# Altium schematic sheet Modulo_22.SchDoc
size A4; SheetNumber: 1; SheetTotal: 1; SPICEModelCacheRCUFKPFU: <root> / <DocumentId>RCUFKPFU</DocumentId> / </root>
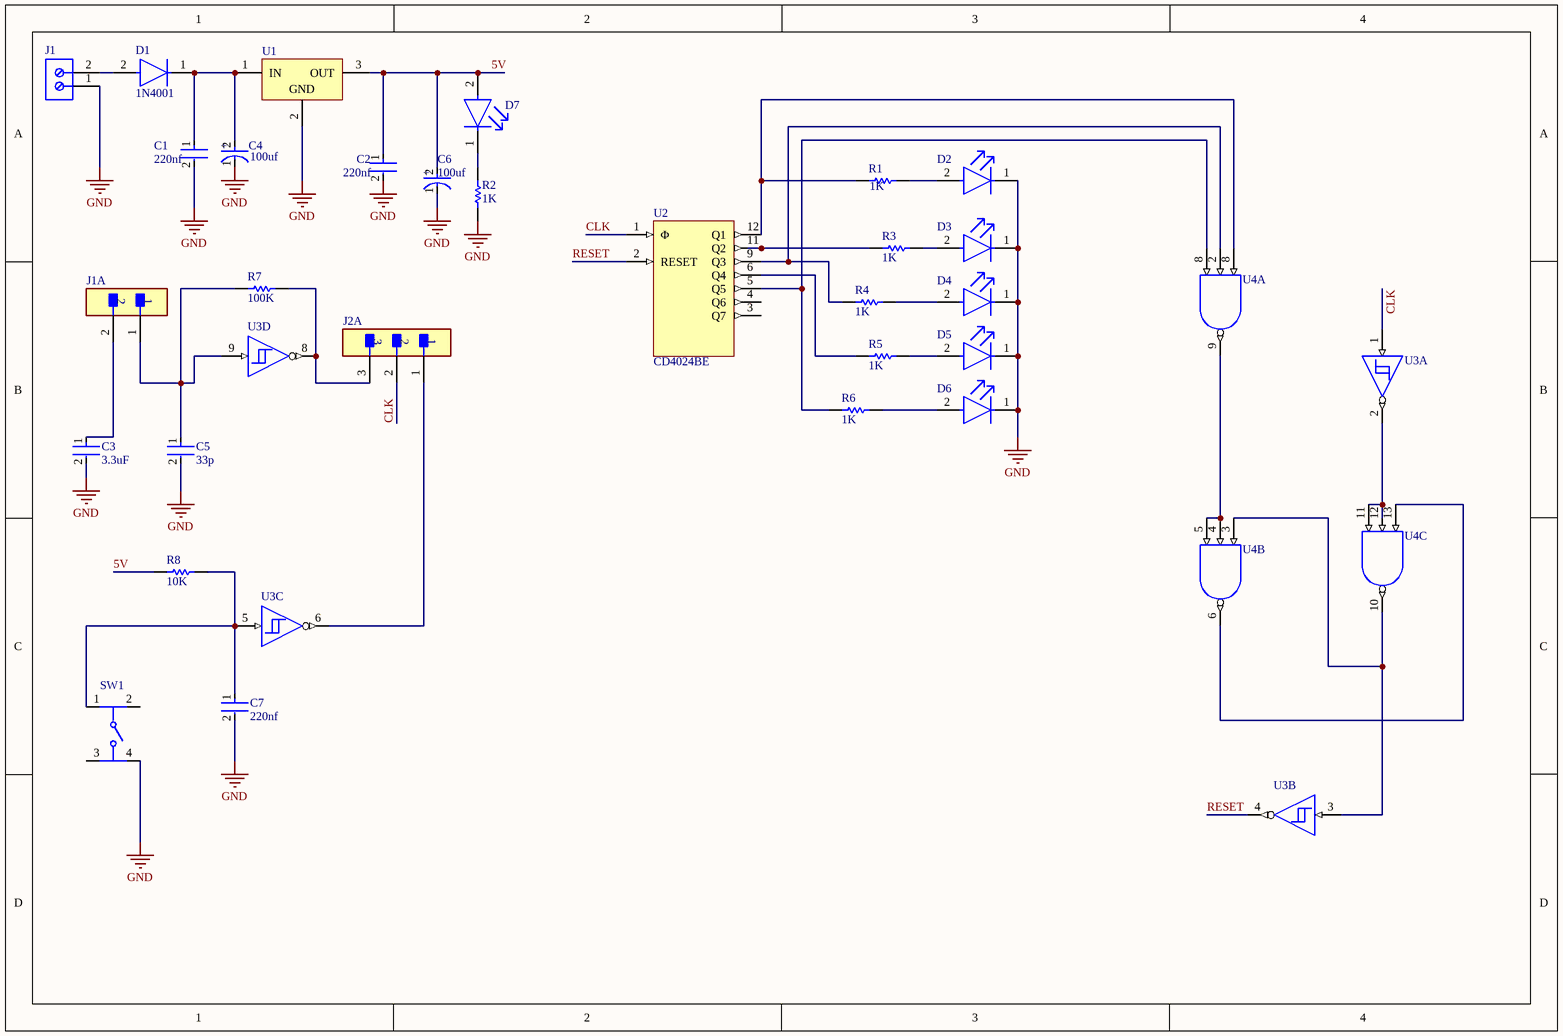
[diagram p0: Modulo_22.SchDoc]

## Parts
C1  220nf  [FP-RDE0P1-MFG]
C2  220nf  [FP-RDE0P1-MFG]
C3  3.3uF  [FP-RDE0P1-MFG]
C4  100uf  [FP-RAD-TH-D_6_3_0_5-L_11-MFG]
C5  33p  [FP-RDE0P1-MFG]
C6  100uf  [FP-RAD-TH-D_6_3_0_5-L_11-MFG]
C7  220nf  [FP-RDE0P1-MFG]
D1  1N4001  [FP-1N4001-E3-73-MFG]
D2  TLLG4400-AS12  [FP-6_544-5255_01-4-MFG]  (value not drawn)
D3  TLLG4400-AS12  [FP-6_544-5255_01-4-MFG]  (value not drawn)
D4  TLLG4400-AS12  [FP-6_544-5255_01-4-MFG]  (value not drawn)
D5  TLLG4400-AS12  [FP-6_544-5255_01-4-MFG]  (value not drawn)
D6  TLLG4400-AS12  [FP-6_544-5255_01-4-MFG]  (value not drawn)
D7  TLLG4400-AS12  [FP-6_544-5255_01-4-MFG]  (value not drawn)
J1  282836-2  [TECO-282836-2_V]  (value not drawn)
J1A  TSW-102-14-G-S  [FP-TSW-102-14-G-S-MFG]  (value not drawn)
J2A  PR20203VBNN  [FP-PR20203VBNN-MFG]  (value not drawn)
R1  1K  [RESA60-630X240]
R2  1K  [RESA60-630X240]
R3  1K  [RESA60-630X240]
R4  1K  [RESA60-630X240]
R5  1K  [RESA60-630X240]
R6  1K  [RESA60-630X240]
R7  100K  [RESA60-630X240]
R8  10K  [RESA60-630X240]
SW1  TL1105AF160Q  [FP-TL1105AF160Q-MFG]  (value not drawn)
U1  L7805CP  [TO220FP]  (value not drawn)
U2  CD4024BE  [N0014A]
U3  CD40106BE  [N0014A]  (value not drawn)  (parts A,B,C,D of 7)
U4  CD4023BF  [J0014A]  (value not drawn)  (parts A,B,C of 4)

## Nets
GND: C1.2 C2.2 C3.2 C4.1(C) C5.2 C6.1(C) C7.2 D2.1(C) D3.1(C) D4.1(C) D5.1(C) D6.1(C) J1.1 R2.1 SW1.4 U1.2(GND)
5V: C2.1 C6.2(A) D7.2(A) R8.1 U1.3(OUT)
CLK: J2A.2 U2.1(Φ) U3.1(A)
RESET: U2.2(RESET) U3.4(H=~{B})
NetC1_1: C1.1 C4.2(A) D1.1(C) U1.1(IN)
NetC3_1: C3.1 J1A.2
NetC5_1: C5.1 J1A.1 R7.1 U3.9(D)
NetC7_1: C7.1 R8.2 SW1.1 U3.5(C)
NetD1_2: D1.2(A) J1.2
NetD2_2: D2.2(A) R1.2
NetD3_2: D3.2(A) R3.2
NetD4_2: D4.2(A) R4.2
NetD5_2: D5.2(A) R5.2
NetD6_2: D6.2(A) R6.2
NetD7_1: D7.1(C) R2.2
NetJ2A_1: J2A.1 U3.6(I=~{C})
NetJ2A_3: J2A.3 R7.2 U3.8(J=~{D})
NetR1_1: R1.1 U2.12(Q1) U4.8(C)
NetR3_1: R3.1 U2.11(Q2)
NetR4_1: R4.1 U2.9(Q3) U4.2(B)
NetR5_1: R5.1 U2.6(Q4)
NetR6_1: R6.1 U2.5(Q5) U4.8(C)
NetU3_2: U3.2(G=~{A}) U4.11(I) U4.12(H)
NetU3_3: U3.3(B) U4.3(D) U4.10(L)
NetU4_4: U4.4(E) U4.5(F) U4.9(J)
NetU4_6: U4.6(K) U4.13(G)

Not connected (* = marked no-connect by the designer): SW1 2 3; U2 3(Q7) 4(Q6)

## Notes on the sheet
- (in symbol CMP-05427-000856-1) +

## Library data of the parts
C1-C3 C5 C7 = CMP-06035-012212-1: Ceramic Capacitor 5pF ±0.25pF 50V C0G Radial; Lead Diameter: 0.5mm; Termination: Radial; Mount: Through Hole; Dielectric: C0G; Height - Seated (Max): 0.236inch; Height: 3.5mm; Length: 0.197inch; Min Operating Temperature: -55°C; Resistor Type: Ceramic; Package Quantity: 500; Voltage Rating: 50V; Lead Pitch: 0.098inch; Width: 0.098inch; Voltage Rating (DC): 50V; Packaging: Bulk; Case/Package: Radial; Max Operating Temperature: 125°C; Capacitance: 5pF
C4 C6 = CMP-05427-000856-1: Aluminum Electrolytic Capacitors (Radial Lead Type) 100uF ±20% 25V; Lead Diameter: 0.5mm; Polarity: Polar; Ripple Current: 455mA; Impedance: 130mR; Life (Hours): 2000Hour; Length: 11mm; Min Operating Temperature: -40°C; Termination: Radial; Diameter: 6mm; Lead Pitch: 5mm; Tolerance: 20%; Capacitance: 100uF; Case/Package: Radial; Voltage Rating (DC): 25V; Height - Seated (Max): 0.5inch; RoHS Compliant: Yes; Series: FM; Package Quantity: 2000; Voltage Rating: 25V; Max Operating Temperature: 105°C; Mount: Through Hole; ESR (Equivalent Series Resistance): 130mR; Packaging: Tape and Reel
D1 = CMP-02540-000001-1: DIODE GEN PURP 50V 1A DO204AL; Manufacturer Part Number: 1N4001-E3/73; Manufacturer: Vishay; Max Surge Forward Current: 30A; Value: 15pF; Peak Reverse Current: 5uA; Max Junction Temp: +150°C; Lead Free: Yes; Height: 2.7mm; Digikey Description: DIODE GEN PURP 50V 1A DO204AL; Reverse Voltage: 50V; Package: 1N4001-E3/73; RoHS: TRUE; Temperature: -50°C to +150°C; Device Class L2: Diodes; Forward Current: 1A; Max Repetitive Reverse Voltage: 50V; Device Class L1: Discrete Semiconductors; Device Class L3: Rectifier Diodes; Capacitance: 15pF; Temperature Range High: +150°C; Category: Diode; Ipc Land Pattern Name: DIOPA1088W105L520D270; ComponentLink2URL: http://www.vishay.com/docs/88503/1n4001.pdf; Octopart: https://octopart.com/1n4001-e3%2F73-vishay-42330130; Automotive: No; ComponentLink2Description: Datasheet; Temperature Range Low: -50°C; Mouser Description: Rectifiers Vr/50V Io/1A
D2-D7 = CMP-02520-000017-1: LED GREEN DIFFUSED T-1 T/H; Number of Elements: 1; Forward Voltage: 2.4V; Luminous Intensity: 2mcd; Reverse Voltage: 20V; Power Dissipation: 20mW; Dominant Wavelength: 575nm; Forward Current: 7mA; Viewing Angle: 50°; Test Current: 2mA; Number of Pins: 2; Lens Style: Diffused; Color: Green; Case/Package: T; Depth: 3.2mm; Length: 3.2mm; Number of LEDs: 1; Mount: Through Hole; Radiation Hardening: No; Max Operating Temperature: 100°C; RoHS Compliant: No; Min Operating Temperature: -40°C; Packaging: Tape and Reel
J1 = CMP-1684-00017-1: Female Header, Pitch 5 mm, 1 x 2 Position, Height 10 mm, Tail Length 3.5 mm, Rohs, Bulk; Manufacturer: TE Connectivity; Wire Gauge: 16-30AWG; Product Training Modules: Wire-to-BoardEurostyleTerminalBlocks; Clamp Material - Plating: Brass-NickelPlated; Voltage: 300V; Mating Orientation: HorizontalwithBoard; Current: 13.5A; Pitch: 0.197"(5.00mm); Screw Thread: M3; 3D Model: 282836-2.pdf; Other Names: 5ULV-02B / A98076; Dynamic Catalog: BuchananSeries; Number of Levels: 1; Torque - Screw: 0.68Nm(6Lb-In); Featured Product: EurostyleTerminalBlockConnectors; Positions Per Level: 2; Wire Termination: Screw-RisingCageClamp; Datasheet URL: http://www.te.com.cn/commerce/DocumentDelivery/DDEController?Action=showdoc&DocId=Catalog+Section%7F1308389_EUROSTYLE_TERMINAL_BLOCKS%7F0607%7Fpdf%7FEnglish%7FENG_CS_1308389_EUROSTYLE_TERMINAL_BLOCKS_0607.pdf%7F282836-2; Color: Green; Family: TerminalBlocks-WiretoBoard; RoHS Information: 282836-2StatementofCompliance; Standard Package: 300; Contact Material - Plating: Brass-TinPlated; Manufacturer URL: http://www.te.com; Housing Material: Polyamide(PA66),Nylon6/6; Features: Interlocking(Side); Package Description: Female Header, Pitch 5 mm, 1 x 2 Position, Height 10 mm, Tail Length 3.5 mm; Mounting Type: ThroughHole; Package Reference: THD; Packaging: Bulk; Series: Buchanan; Category: Connectors,Interconnects; Screw Material - Plating: Brass-NickelPlated
J1A = CMP-02766-001740-1: CONN HEADER VERT 2POS 2.54MM; Number of Positions: 2; Max Current Rating: 7.6A; Gender: Male; Max Voltage Rating (AC): 550V; Contact Mating Length: 0.32inch; REACH SVHC: No SVHC; Width: 2.54mm; Insulation Material: PBT; Contact Shape: Square; Contact Plating: Gold; Min Operating Temperature: -55°C; Contact Material: Bronze; Color: Black; Number of Contacts: 2; Housing Material: Polyester; Orientation: Straight; Flammability Rating: UL94 V-0; Max Operating Temperature: 125°C; Contact Type: Male Pin; Radiation Hardening: No; Termination: Solder; RoHS Compliant: Yes; Lead Free: Lead Free; Fastening Type: Pull; Pitch: 2.54mm; Number of Rows: 1; Series: TSW; Insulation Color: Black; Package Quantity: 1; Connector Type: Header; Length: 5.08mm; Contact Finish - Mating: GOLD; Mount: Through Hole; Housing Color: Black; Depth: 2.54mm; Packaging: Bulk
J2A = CMP-77940-000002-1: CONN HEADER VERT 3POS 2.54MM; Manufacturer: Metz Connect; Conn Orientation: Straight; Current Rating: 3A; Number Of Contacts: 3; Conn Gender: Male; Temperature: -40°C to +105°C; Pitch: 2.54mm; Device Class L1: Connectors; Digikey Description: CONN HEADER VERT 3POS 2.54MM; ComponentLink2URL: https://datasheet.octopart.com/PR20203VBNN-Metz-Connect-datasheet-101610322.pdf; Height: 8.6mm; Temperature Range High: +105°C; Manufacturer Part Number: PR20203VBNN; Number Of Rows: 1; Octopart: https://octopart.com/pr20203vbnn-metz+connect-87667116; Device Class L3: unset; ComponentLink2Description: Datasheet; Device Class L2: Headers and Wire Housings; Temperature Range Low: -40°C; Automotive: No; Contact Material: Gold,Nickel; Category: Conn; Lead Free: Yes; RoHS: TRUE; Package: PR20203VBNN
R1-R8 = CMP-1659-00075-1: Axial Resistor, 1 KOhm, +/- 1%, 250 mW, -55 to 155 degC, 2-Pin THD, RoHS, Bulk; Voltage Rating: 250 V; Resistance: 10 kohm; Power Rating: 250 mW; ComponentLink2Description: Datasheet; RoHSCompliant: true; PackageReference: MFR-25; Case\Package: Axial; Max Operating Temperature: 155 degC; DatasheetVersion: Apr-13; Tolerance: 1%; ComponentLink1URL: http://www.yageo.com/; Length: 0.248 inch; ComponentLink2URL: http://www.yageo.com/documents/recent/Yageo%20LR_MFR_2013.pdf; Packaging: Bulk; Package Quantity: 200; PackageDescription: 2-Pin Axial Lead, Dia 2.4 mm, Body Length 6.3 mm; Min Operating Temperature: -55 degC; ComponentLink1Description: Manufacturer URL
SW1 = CMP-17879-000016-1: SWITCH TACTILE SPST-NO 0.05A 12V; Mechanical Life: 100000Cycles; Contact Current Rating: 50mA; Contact Resistance: 100mR; Switch Function: Off-Mom; Actuator Type: Standard; Actuator Length: 1.4mm; Max Voltage Rating (DC): 50V; Throw Configuration: SPST; Actuator Material: Nylon; Illumination Type: Non-Illuminated; Switch Travel: 0.25mm; Operating Force: 160gf; Package Quantity: 750; Width: 6mm; Series: TL1105; Voltage Rating (DC): 12V; Length: 6mm; Contact Plating: Silver; Color: Black; Housing Material: Nylon; Min Operating Temperature: -20°C; Lead Free: Lead Free; Mount: Through Hole; Termination: PC Pin; RoHS Compliant: Yes; Orientation: Straight; Max Operating Temperature: 70°C; Reach SVHC Compliant: Yes; Packaging: Bulk; Electrical Life: 100000Cycles; Current Rating: 50mA; Contact Material: Bronze; Size: 6mm
U1 = CMP-0244-00474-1: Positive Voltage Regulator, 5V, 3-Pin TO-220FP; ComponentLink1Description: Manufacturer URL; ComponentLink2Description: Datasheet; DatasheetVersion: 16/11/2011; PackageDescription: TO, Thru-Hole, Vertical, Heatsink Mounted; 3 In-Line Leads; Pitch 2.54 mm; ComponentLink2URL: http://www.st.com/internet/com/TECHNICAL_RESOURCES/TECHNICAL_LITERATURE/DATASHEET/CD00000444.pdf; ComponentLink1URL: http://www.st.com; PackageVersion: 2011; PackageReference: TO220FP
U2 = CMP-1623-00482-2: CMOS 7-Stage Ripple-Carry Binary Counter/Divider, N0014A, TUBE; Manufacturer: Texas Instruments; Voltage(Nom)(V): 10; Rating: Military; Inputs: 1; Output Drive (IOL/IOH)(Max)(mA): 1.5/-1.5; Bits(#): 12; VCC(Max)(V): 18; Technology Family: CD4000; F @ Nom Voltage(Max)(Mhz): 8; Schmitt Trigger: No; ICC @ Nom Voltage(Max)(mA): 0.03; tpd @ Nom Voltage(Max)(ns): 160; VCC(Min)(V): 3; Operating Temperature Range(C): -55 to 125; Input Type: CMOS; Function: Counter; Generic Part Number: CD4024B; Code_JEDEC: MS-001; Output Type: CMOS; DatasheetVersion: SCHS030D; Type: Binary; PackageReference: N0014A
U3 = CMP-1615-00909-3: CMOS Hex Schmitt Triggers, N0014A, TUBE; Manufacturer: Texas Instruments; F @ Nom Voltage(Max)(Mhz): 12; Rating: Catalog; Output Drive (IOL/IOH)(Max)(mA): -1/1; Voltage(Nom)(V): 5; VCC(Min)(V): 3; Bits(#): 6; Technology Family: CD4000; ICC @ Nom Voltage(Max)(mA): 0.03; Schmitt Trigger: Yes; tpd @ Nom Voltage(Max)(ns): 280; VCC(Max)(V): 18; DatasheetVersion: SCHS097D; Code_JEDEC: MS-001; Input Type: CMOS; Output Type: CMOS; Operating Temperature Range(C): -55 to 125; PackageReference: N0014A; Generic Part Number: CD40106B
U4 = CMP-1627-00322-2: CMOS Triple 3-Input NAND Gate, J0014A, TUBE; Manufacturer: Texas Instruments; Bits(#): 3; F @ Nom Voltage(Max)(Mhz): 8; VCC(Max)(V): 18; Voltage(Nom)(V): 10; Schmitt Trigger: No; Technology Family: CD4000; Rating: Military; ICC @ Nom Voltage(Max)(mA): 0.015; Output Drive (IOL/IOH)(Max)(mA): 1.5/-1.5; Operating Temperature Range(C): -55 to 125; VCC(Min)(V): 3; Output Type: CMOS; Input Type: CMOS; PackageReference: J0014A; DatasheetVersion: SCHS021D; Generic Part Number: CD4023B